# Altium schematic sheet ADC_40M20b.SchDoc: 20bit_40MS_ADC_DIOT
size A3; Author: M.Beldyga; CompanyName: WUT ISE; DrawnBy: M.Beldyga; Organization: WUT ISE; Address1: PW ISE; Address2: Nowowiejska 15/19 00-665 Warsaw; Address3: micbeldyga@gmail.com; SheetNumber: 1; SheetTotal: 10; ModifiedBy: -; CheckedDate: -; Title2: 2ch 20bit 40Msps isolated ADC; DivGrp: WUT ISE; Designer: M.Beldyga; ModifiedDate: -; ProjectName: Sensor Box
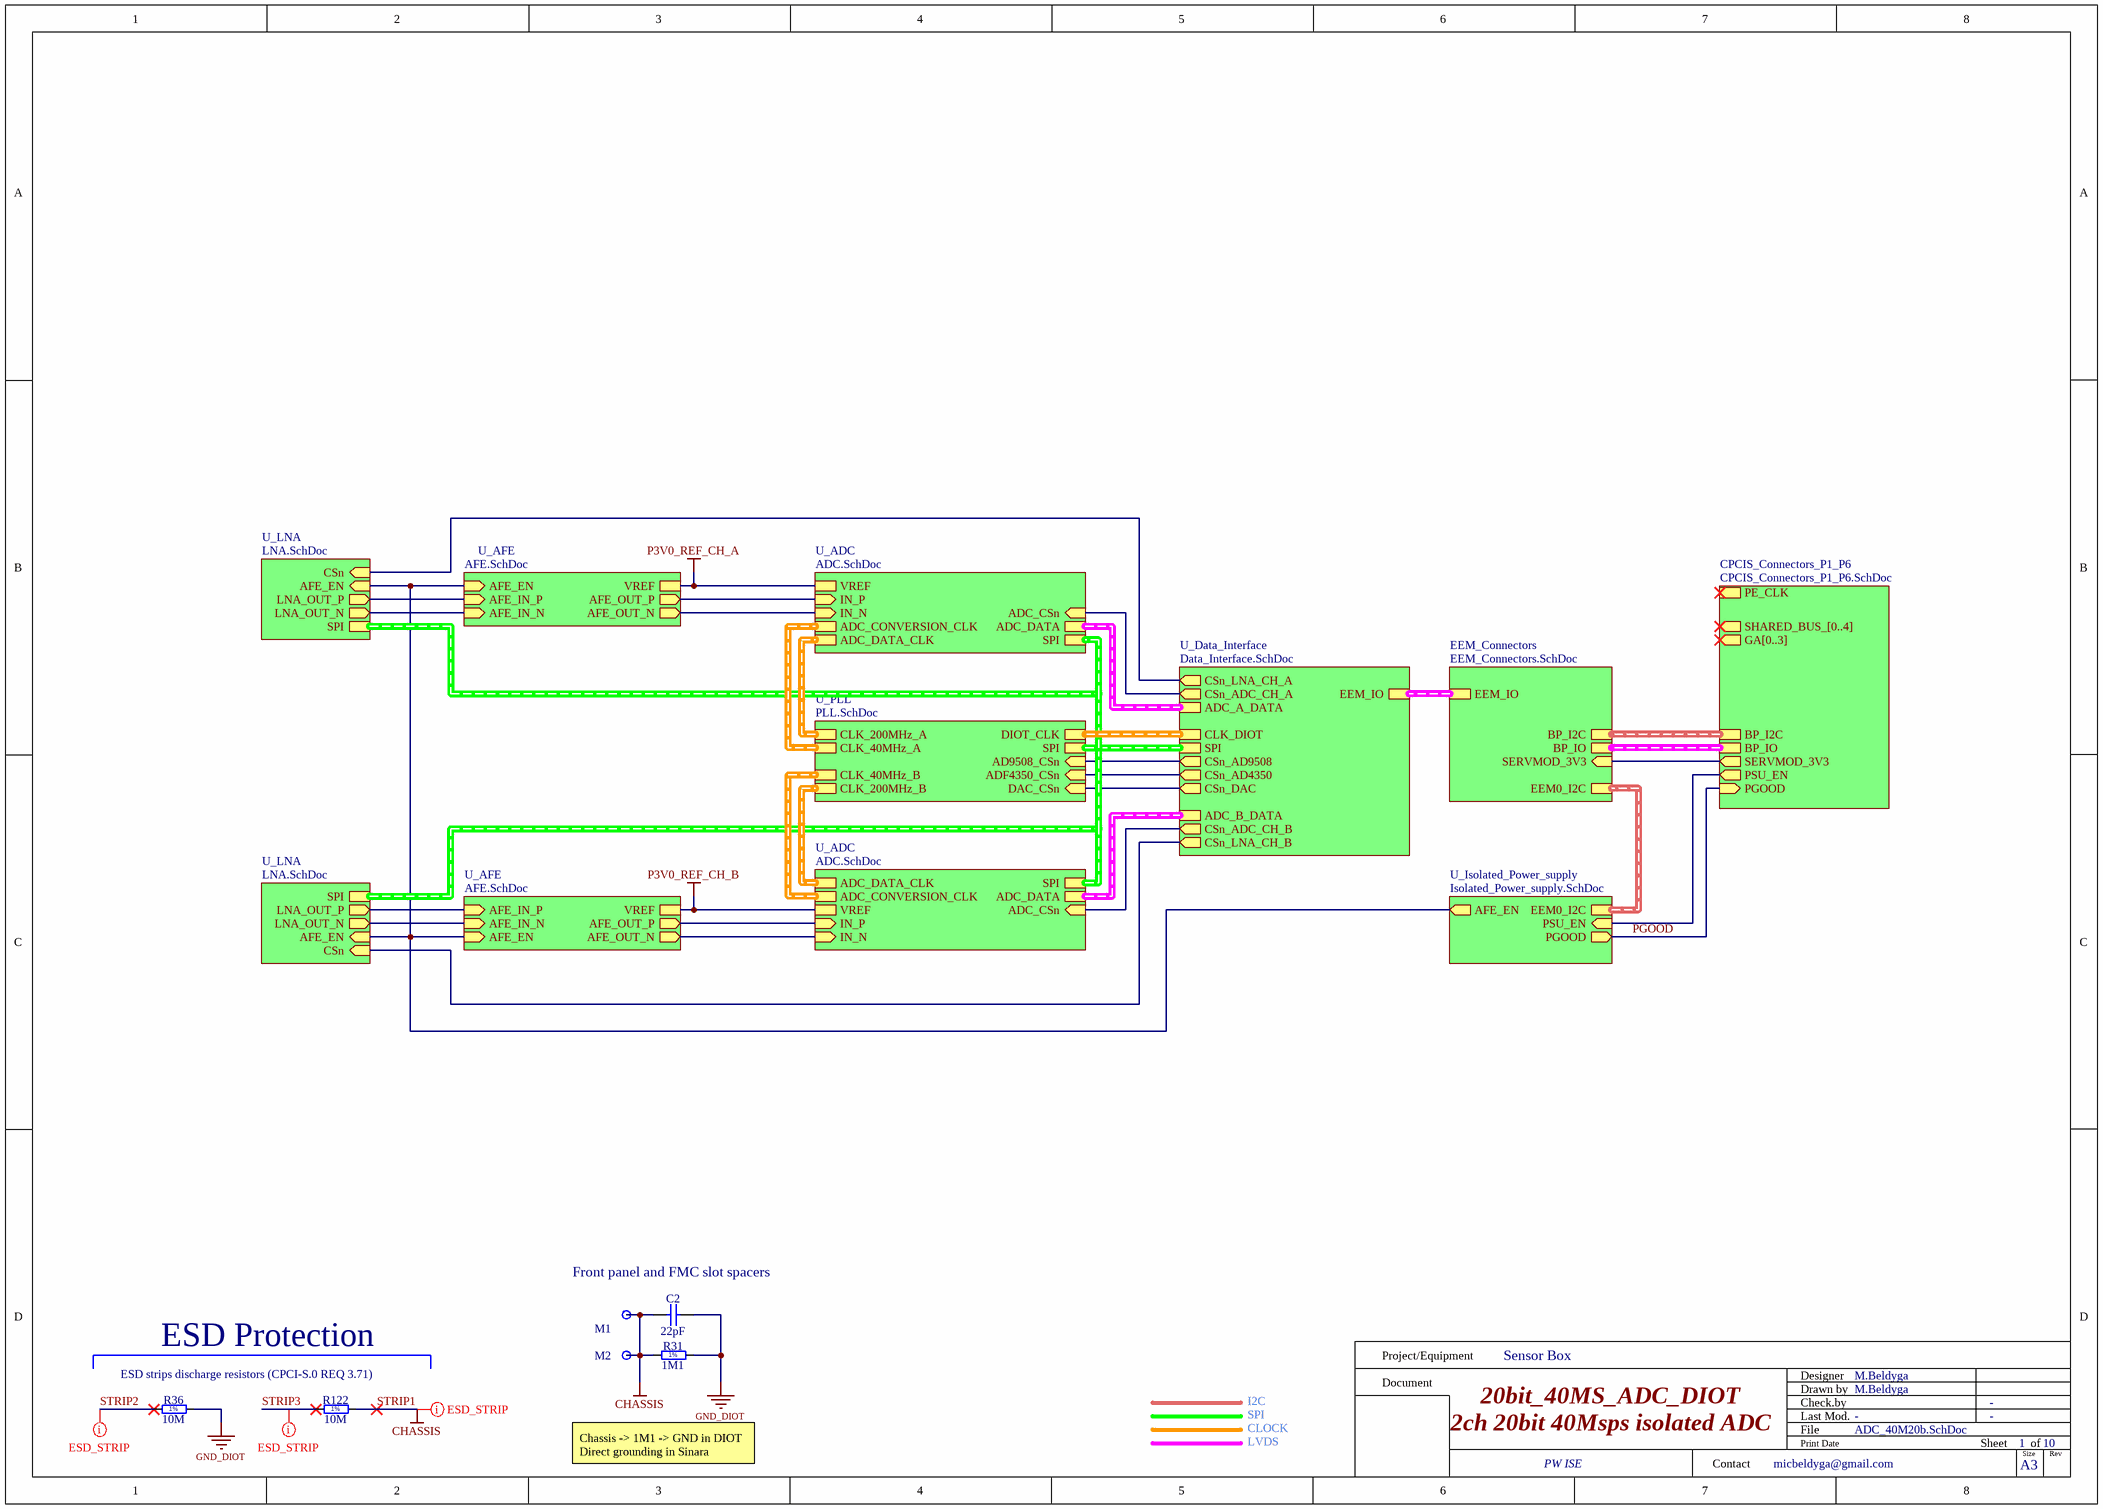
[diagram p0: ADC_40M20b.SchDoc]

## Parts
C2  22pF  [CAPC1005X55N]
M1  Plated Hole  [MTG300_600]  (value not drawn)  (no BOM)
M2  Plated Hole  [MTG300_600]  (value not drawn)  (no BOM)
R31  1M1  [RESC2012X60N]
R36  10M  [RESC2113X55N]
R122  10M  [RESC2113X55N]

## Sub-sheets
CPCIS_Connectors_P1_P6 = CPCIS_Connectors_P1_P6.SchDoc: BP_I2C (harness I2C), SERVMOD_3V3 (out), PSU_EN (out), PE_CLK (harness CLK_DIFF), GA[0..3] (out), BP_IO (harness EEM_LVDS), SHARED_BUS_[0..4] (out), PGOOD (in)
EEM_Connectors = EEM_Connectors.SchDoc: EEM_IO (harness EEM_LVDS), BP_IO (harness EEM_LVDS), EEM0_I2C (harness I2C), BP_I2C (harness I2C), SERVMOD_3V3 (in)
U_ADC = ADC.SchDoc: ADC_DATA (harness ADC_LVDS), SPI (harness SPI), ADC_CONVERSION_CLK (harness DIFF_CLK), ADC_DATA_CLK (harness DIFF_CLK), IN_P (in), IN_N (in), ADC_CSn (in), VREF
U_ADC = ADC.SchDoc: ADC_DATA (harness ADC_LVDS), SPI (harness SPI), ADC_CONVERSION_CLK (harness DIFF_CLK), ADC_DATA_CLK (harness DIFF_CLK), IN_P (in), IN_N (in), ADC_CSn (in), VREF
U_AFE = AFE.SchDoc: AFE_OUT_P (out), AFE_OUT_N (out), AFE_IN_P (in), AFE_IN_N (in), AFE_EN (in), VREF
U_AFE = AFE.SchDoc: AFE_OUT_P (out), AFE_OUT_N (out), AFE_IN_P (in), AFE_IN_N (in), AFE_EN (in), VREF
U_Data_Interface = Data_Interface.SchDoc: ADC_A_DATA (harness ADC_LVDS), ADC_B_DATA (harness ADC_LVDS), SPI (harness SPI), CLK_DIOT (harness DIFF_CLK), CSn_ADC_CH_A (out), CSn_ADC_CH_B (out), CSn_AD9508 (out), CSn_AD4350 (out), CSn_LNA_CH_A (out), CSn_LNA_CH_B (out), EEM_IO (harness EEM_LVDS), CSn_DAC (out)
U_Isolated_Power_supply = Isolated_Power_supply.SchDoc: PSU_EN (in), EEM0_I2C (harness I2C), PGOOD (out), AFE_EN (out)
U_LNA = LNA.SchDoc: LNA_OUT_P (out), LNA_OUT_N (out), SPI (harness SPI), AFE_EN (in), CSn (in)
U_LNA = LNA.SchDoc: LNA_OUT_P (out), LNA_OUT_N (out), SPI (harness SPI), AFE_EN (in), CSn (in)
U_PLL = PLL.SchDoc: CLK_40MHz_A (harness DIFF_CLK), CLK_200MHz_A (harness DIFF_CLK), CLK_40MHz_B (harness DIFF_CLK), CLK_200MHz_B (harness DIFF_CLK), SPI (harness SPI), ADF4350_CSn (in), AD9508_CSn (in), DIOT_CLK (harness DIFF_CLK), DAC_CSn (in)

## Nets
GND_DIOT: C2.2 R31.2 R36.2
P3V0_REF_CH_A: sheet U_AFE/VREF, sheet U_ADC/VREF
P3V0_REF_CH_B: sheet U_ADC/VREF, sheet U_AFE/VREF
STRIP1: C2.1 M1.1 M2.1 R31.1 R122.2  [also labelled CHASSIS]
PGOOD: sheet CPCIS_Connectors_P1_P6/PGOOD, sheet U_Isolated_Power_supply/PGOOD
STRIP2: R36.1
STRIP3: R122.1
(unnamed): sheet CPCIS_Connectors_P1_P6/SERVMOD_3V3, sheet EEM_Connectors/SERVMOD_3V3
(unnamed): sheet CPCIS_Connectors_P1_P6/PSU_EN, sheet U_Isolated_Power_supply/PSU_EN
(unnamed): sheet U_AFE/AFE_OUT_P, sheet U_ADC/IN_P
(unnamed): sheet U_AFE/AFE_OUT_N, sheet U_ADC/IN_N
(unnamed): sheet U_AFE/AFE_IN_P, sheet U_LNA/LNA_OUT_P
(unnamed): sheet U_AFE/AFE_IN_N, sheet U_LNA/LNA_OUT_N
(unnamed): sheet U_AFE/AFE_EN, sheet U_LNA/AFE_EN, sheet U_AFE/AFE_EN, sheet U_LNA/AFE_EN, sheet U_Isolated_Power_supply/AFE_EN
(unnamed): sheet U_LNA/CSn, sheet U_Data_Interface/CSn_LNA_CH_A
(unnamed): sheet U_ADC/ADC_CSn, sheet U_Data_Interface/CSn_ADC_CH_A
(unnamed): sheet U_PLL/ADF4350_CSn, sheet U_Data_Interface/CSn_AD4350
(unnamed): sheet U_PLL/AD9508_CSn, sheet U_Data_Interface/CSn_AD9508
(unnamed): sheet U_PLL/DAC_CSn, sheet U_Data_Interface/CSn_DAC
(unnamed): sheet U_ADC/IN_P, sheet U_AFE/AFE_OUT_P
(unnamed): sheet U_ADC/IN_N, sheet U_AFE/AFE_OUT_N
(unnamed): sheet U_ADC/ADC_CSn, sheet U_Data_Interface/CSn_ADC_CH_B
(unnamed): sheet U_AFE/AFE_IN_P, sheet U_LNA/LNA_OUT_P
(unnamed): sheet U_AFE/AFE_IN_N, sheet U_LNA/LNA_OUT_N
(unnamed): sheet U_LNA/CSn, sheet U_Data_Interface/CSn_LNA_CH_B

## Buses and harness runs
harness sheet CPCIS_Connectors_P1_P6/BP_I2C = sheet EEM_Connectors/BP_I2C
harness sheet CPCIS_Connectors_P1_P6/BP_IO = sheet EEM_Connectors/BP_IO
harness sheet EEM_Connectors/EEM0_I2C = sheet U_Isolated_Power_supply/EEM0_I2C
harness sheet EEM_Connectors/EEM_IO = sheet U_Data_Interface/EEM_IO
harness sheet U_ADC/ADC_CONVERSION_CLK = sheet U_PLL/CLK_40MHz_A
harness sheet U_ADC/ADC_CONVERSION_CLK = sheet U_PLL/CLK_40MHz_B
harness sheet U_ADC/ADC_DATA = sheet U_Data_Interface/ADC_A_DATA
harness sheet U_ADC/ADC_DATA = sheet U_Data_Interface/ADC_B_DATA
harness sheet U_ADC/ADC_DATA_CLK = sheet U_PLL/CLK_200MHz_A
harness sheet U_ADC/ADC_DATA_CLK = sheet U_PLL/CLK_200MHz_B
harness sheet U_ADC/SPI = sheet U_Data_Interface/SPI = sheet U_LNA/SPI = sheet U_PLL/SPI
harness sheet U_Data_Interface/CLK_DIOT = sheet U_PLL/DIOT_CLK

## Layout directives
net class ESD_STRIP: STRIP1, STRIP2, STRIP3

## Notes on the sheet
- Front panel and FMC slot spacers
- ESD strips discharge resistors (CPCI-S.0 REQ 3.71)
- ESD Protection
- Chassis -> 1M1 -> GND in DIOT
  Direct grounding in Sinara
- I2C
- SPI
- CLOCK
- LVDS
- Project/Equipment
- Document
- Designer
- Drawn by
- Check.by
- Contact
- File
- Last Mod.
- Print Date
- Sheet
- Size
- A3
- of
- Rev
- (in symbol R0805_1M1_1%_0.125W_100PPM) 1%
- (in symbol R0805_10M_1%_0.125W_100PPM_VISHAY_CRCW e3) 1%

## Library data of the parts
C2 = CC0402_22PF_50V_5%_C0G: Non-polarised capacitor; Part Description: SMD Multilayer Chip Ceramic Capacitor; Manufacturer: GENERIC; Manufacturer1 Part Number: C0402C220J5GACTU; Voltage: 50V; TC: C0G/NP0; Tolerance: ±5%; Part Number: CC0402_22PF_50V_5%_C0G; Component Kind: Standard; Component Type: Standard; Pin Count: 2; Value: 22pF; Status: Preferred; Manufacturer Part Number: CC0402_22PF_50V_5%_C0G; Case: 0402; Mounted: Yes; Socket: No; SMD: Yes; Manufacturer1 Example: KEMET; Manufacturer1 ComponentHeight: 0.55mm; HelpURL: \\cern.ch\dfs\Applications\Altium\Datasheets\CC0402_C0G_KEMET_(Commercial Grade).pdf; Author: CERN DEM JLC; CreateDate: 2007-12-03; LatestRevisionDate: 2007-12-03; Sense: No
M1 M2 = PLATED_HOLE3.0_PAD6.0: Single Terminal Socket; Part Description: Plated Through Hole: Hole Dia.=3.0mm Pad Dia.=6.0mm; Mounted: No; Table: Pads; Part Number: PLATED_HOLE3.0_PAD6.0; Component Type: Standard (No BOM); Designator: Single Terminal Socket; Library Reference: Single Terminal Socket; Pin Count: 1; Family: Plated Hole; Socket: No; SMD: No; Status: None; ComponentHeight: 0mm; Author: CERN DEM JLC; CreateDate: 26.05.2008; LatestRevisionDate: 26.05.2008; PackageDescription: Plated Through Hole: Hole Dia.=3.0mm Pad Dia.=6.0mm
R31 = R0805_1M1_1%_0.125W_100PPM: Resistor - 1%; Part Description: General Purpose Thick Film Chip Resistor; Manufacturer: GENERIC; Manufacturer1 Part Number: NRC10F1104TRF; PressFit: No; Part Number: R0805_1M1_1%_0.125W_100PPM; Component Kind: Standard; Component Type: Standard; Pin Count: 2; Value: 1M1; Status: Preferred; Manufacturer Part Number: R0805_1M1_1%_0.125W_100PPM; Case: 0805; Mounted: Yes; Sense: No; Socket: No; SMD: Yes; Manufacturer1 Example: NIC COMPONENT; Manufacturer1 ComponentHeight: 0.6mm; HelpURL: \\cern.ch\dfs\Applications\Altium\Datasheets\R0805_NIC_NRC.pdf; Author: CERN DEM JLC; CreateDate: 03/12/2007; LatestRevisionDate: 13/03/2008
R36 R122 = R0805_10M_1%_0.125W_100PPM_VISHAY_CRCW e3: Resistor - 1%; Part Description: 150V, Standard Thick Film Chip Resistor; Manufacturer: VISHAY DALE; Manufacturer Part Number: CRCW080510M0FKEA; Power: 0.125W; TC: ±100ppm/°C; PressFit: No; Part Number: R0805_10M_1%_0.125W_100PPM_VISHAY_CRCW e3; Component Kind: Standard; Component Type: Standard; Pin Count: 2; Value: 10M; Status: None; Tolerance: ±1%; Case: 0805; Mounted: Yes; Sense: No; Socket: No; SMD: Yes; ComponentHeight: 0.5mm; HelpURL: \\cern.ch\dfs\Applications\Altium\Datasheets\R0805_VISHAY_CRCW e3.pdf; Author: CERN DEM BC; CreateDate: 2019-11-12; LatestRevisionDate: 2019-11-12